# Altium schematic sheet PWR_SRC.SchDoc
size A3
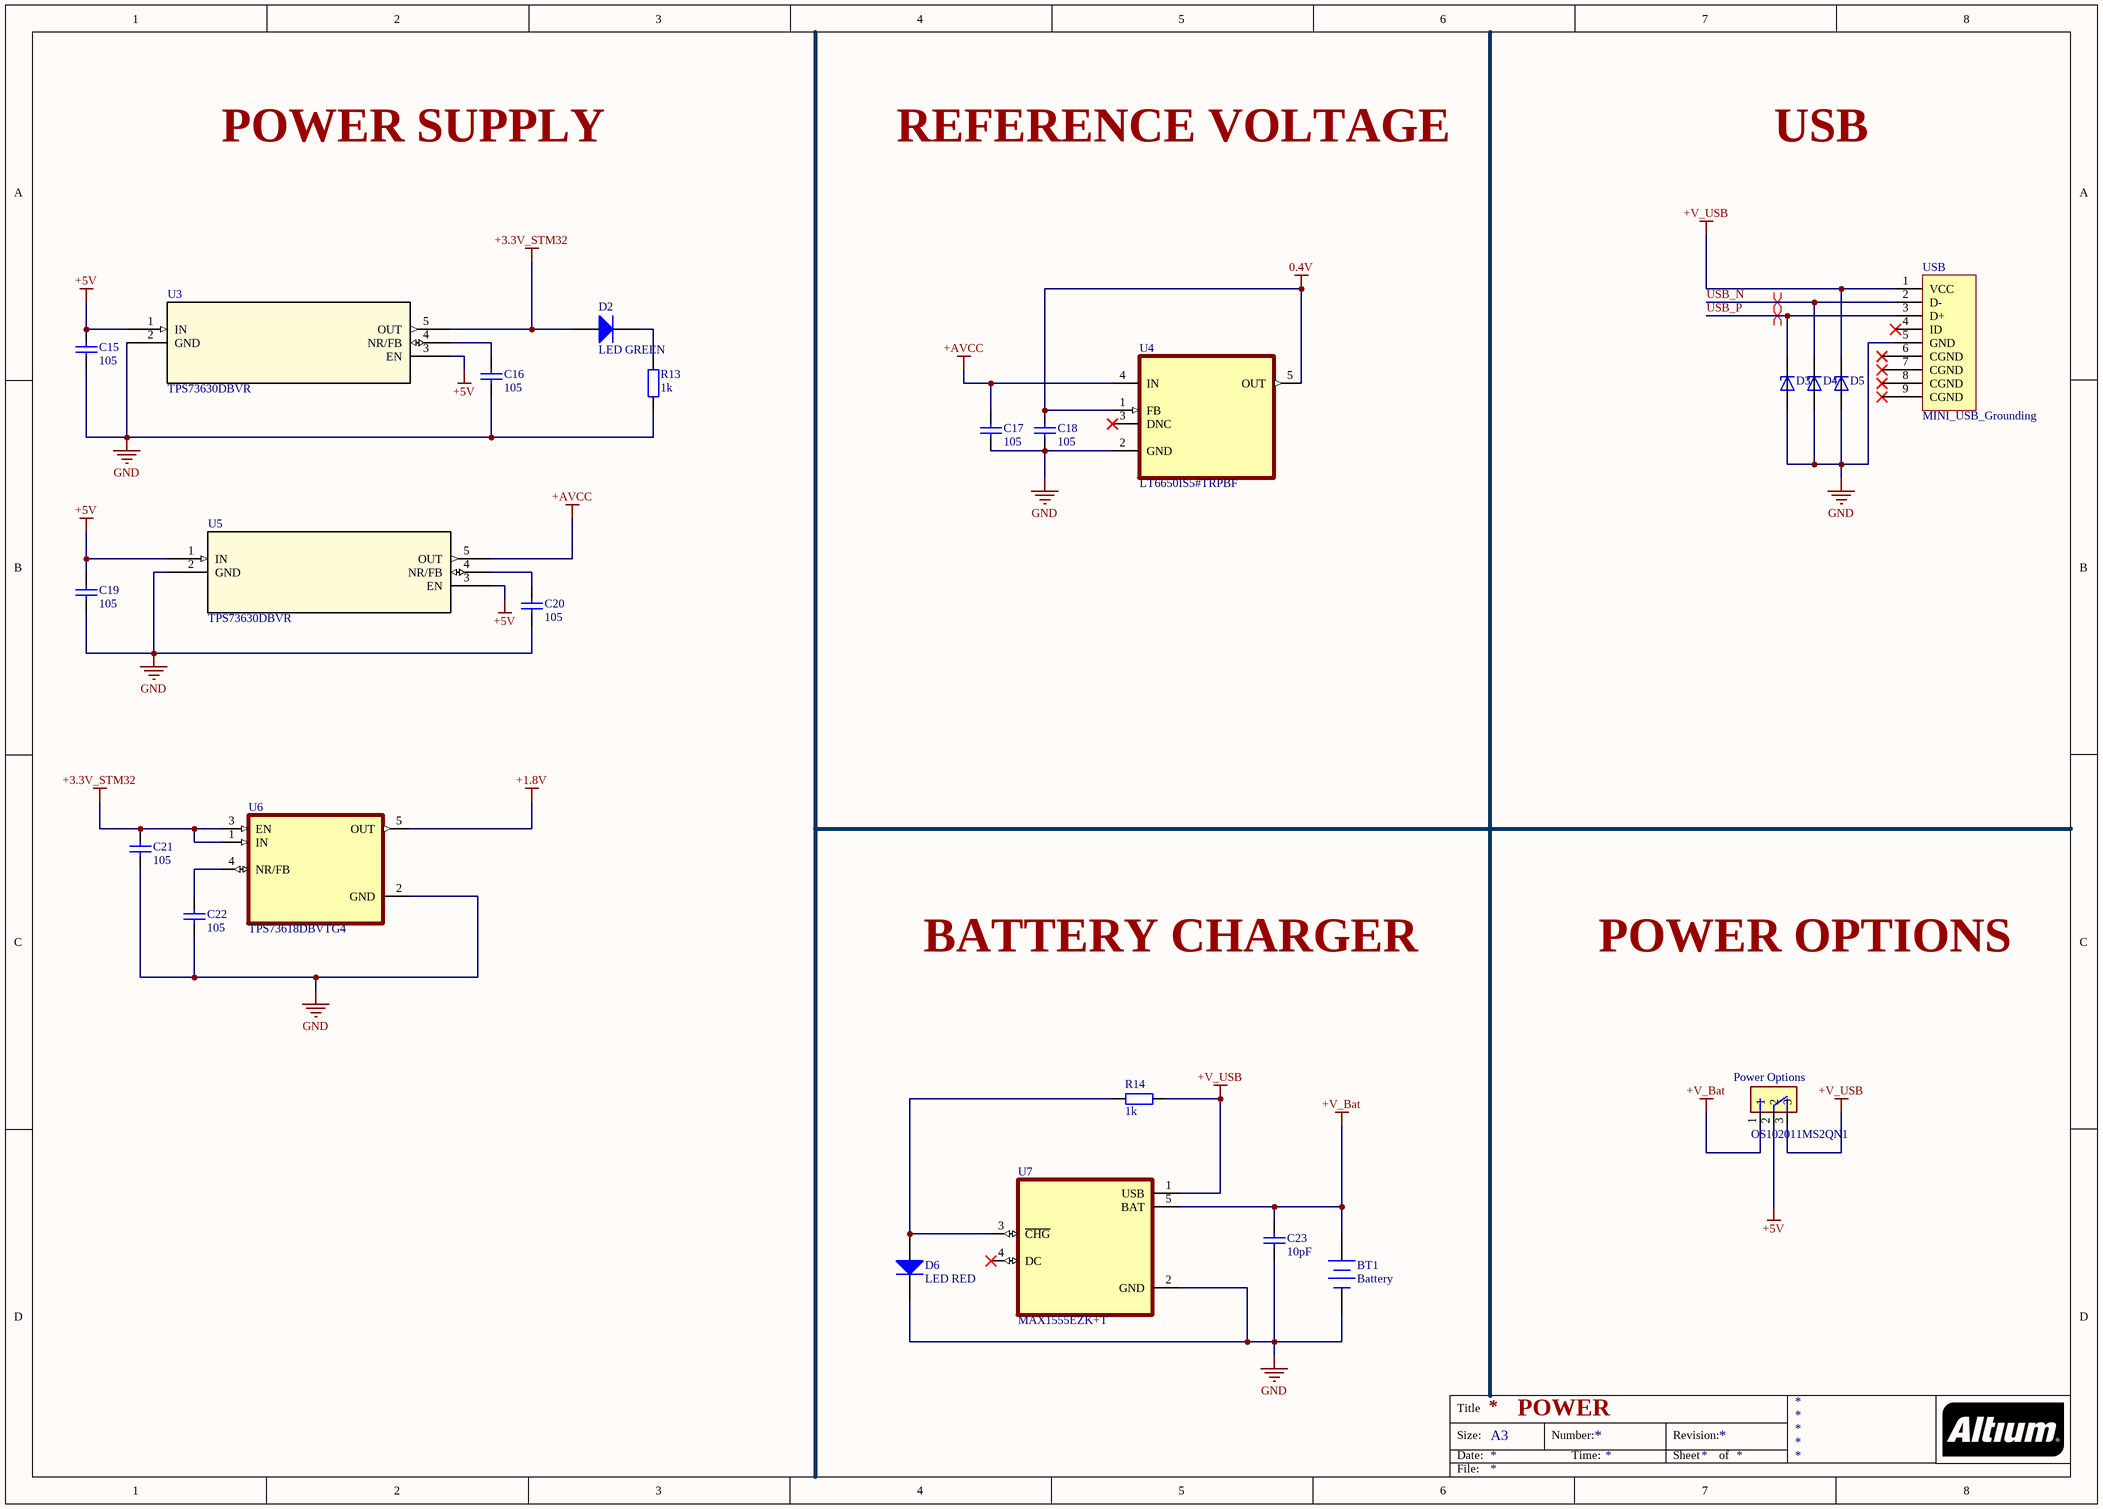
[diagram p0: PWR_SRC.SchDoc]

## Parts
BT1  Battery  [BAT-2]
C15  105  [tu 0603]
C16  105  [tu 0603]
C17  105  [tu 0603]
C18  105  [tu 0603]
C19  105  [tu 0603]
C20  105  [tu 0603]
C21  105  [tu 0603]
C22  105  [tu 0603]
C23  10pF  [tu 0805]
D2  LED GREEN  [J1-0603]
D3  AVRL161A1R1NTA  [TVS_AVRL161A1R1NTA]  (value not drawn)
D4  AVRL161A1R1NTA  [TVS_AVRL161A1R1NTA]  (value not drawn)
D5  AVRL161A1R1NTA  [TVS_AVRL161A1R1NTA]  (value not drawn)
D6  LED RED  [J1-0603]
Power_Options  OS102011MS2QN1  [SW_OS102011MS2QN1]
R13  1k  [tro smd 0603]
R14  1k  [tro smd 0603]
U3  TPS73630DBVR  [DBV5-M]
U4  LT6650IS5#TRPBF  [SOT95P280X100-5N]
U5  TPS73630DBVR  [DBV5-M]
U6  TPS73618DBVTG4  [SOT95P280X145-5N]
U7  MAX1555EZK+T  [SOT95P275X110-5N]
USB  MINI_USB_Grounding  [micro_USB shilding]

## Nets
0.4V: C18.1 U4.1(FB) U4.5(OUT)
+1.8V: U6.5(OUT)
+3.3V_STM32: C21.1 D2.1(A) U3.5(OUT) U6.1(IN) U6.3(EN)
+5V: C15.1 C19.1 Power_Options.2 U3.1(IN) U3.3(EN) U5.1(IN) U5.3(EN)
+AVCC: C17.1 U4.4(IN) U5.5(OUT)
+V_Bat: BT1.1(+) C23.1 Power_Options.1 U7.5(BAT)
+V_USB: D5.1(C) Power_Options.3 R14.2 U7.1(USB) USB.1(VCC)
GND: BT1.2(-) C15.2 C16.2 C17.2 C18.2 C19.2 C20.2 C21.2 C22.2 C23.2 D3.2(A) D4.2(A) D5.2(A) D6.2(K) R13.2 U3.2(GND) U4.2(GND) U5.2(GND) U6.2(GND) U7.2(GND) USB.5(GND)
USB_N: D4.1(C) USB.2(D-)
USB_P: D3.1(C) USB.3(D+)
NetC16_1: C16.1 U3.4(NR/FB)
NetC20_1: C20.1 U5.4(NR/FB)
NetC22_1: C22.1 U6.4(NR/FB)
NetD2_2: D2.2(K) R13.1
NetD6_1: D6.1(A) R14.1 U7.3(~{CHG})

Not connected (* = marked no-connect by the designer): U4 3(DNC)*; U7 4(DC)*; USB 4(ID)* 6(CGND)* 7(CGND)* 8(CGND)* 9(CGND)*

## Layout directives
differential pair; differential pair class diff90: USB_N, USB_P

## Notes on the sheet
- POWER SUPPLY
- REFERENCE VOLTAGE
- USB
- BATTERY CHARGER
- POWER OPTIONS
- POWER
- Title
- Size:
- Date:
- A3
- Number:
- Time:
- Revision:
- Sheet
- of
- File:

## Library data of the parts
BT1 = Battery: Multicell Battery; Published: 24-Mar-1999; LatestRevisionDate: 17-Jul-2002; LatestRevisionNote: Re-released for DXP Platform.; PackageReference: BAT-2; Publisher: Altium Limited; PackageDescription: Battery; 2 Leads
C15-C22 = Tu 0603 105 16V 20%: Dán; Don_Vi: Con; So_Chan: 2; Ten_Linh_Kien: Tụ 0603 105-1uF 20% 16V; Ma_Hang: MH004574; Chung_Loai: Dán; Kieu_Chan: *
C23 = Tu 0805 10pF 50V 10%: Dán; Don_Vi: Con; So_Chan: 2; Ten_Linh_Kien: Tụ 0805 10P 10% 50V; Ma_Hang: MH004554; Chung_Loai: Dán; Kieu_Chan: *
D2 D6 = Diode: Default Diode; Published: 8-Jun-2000; LatestRevisionDate: 17-Jul-2002; LatestRevisionNote: Re-released for DXP Platform.; PackageDocument: Sep-1996; PackageReference: SMC; Publisher: Altium Limited; Code_JEDEC: DO-214-AB
D3-D5 = AVRL161A1R1NTA: MF: {'manufacturer': u'TDK'}; Package: None; Price: None; Value: *; MP: AVRL161A1R1NTA; Availability: Unavailable
Power_Options = OS102011MS2QN1: Switch Slide ON ON SPDT Top Slide 0.1A 12VDC 10000Cycles PC Pins Thru-Hole Bulk; MF: {'manufacturer': u'C&K'}; Package: None; Price: None; Value: *; MP: OS102011MS2QN1; Availability: Unavailable
R13 = Tro 0603 5% 1k: Dán; Don_Vi: Con; So_Chan: 2; Ten_Linh_Kien: Trở 0603 5% 1k; Ma_Hang: MH006319; Chung_Loai: Dán; Kieu_Chan: *
R14 = Tro 0603 1% 1k: Dán; So_Chan: 2; Don_Vi: Con; Ten_Linh_Kien: Trở 0603 1% 1k; Ma_Hang: MH006334; Chung_Loai: Dán; Kieu_Chan: *
U3 U5 = TPS73630DBVR: No Description Available; Mfr_Name: Texas Instruments; RefDes: RefDes; Type: Type
U4 = LT6650IS5#TRPBF: Micropower, 400mV Reference with Rail-to-Rail Buffer Amplifier; MF: {'manufacturer': u'Analog Devices'}; Package: None; Price: None; Value: *; MP: LT6650IS5#TRPBF; Availability: Unavailable
U6 = TPS73618DBVTG4: MF: {'manufacturer': u'Texas Instruments'}; Package: None; Price: None; Value: *; MP: TPS73618DBVTG4; Availability: Unavailable
U7 = MAX1555EZK+T: MF: {'manufacturer': u'Analog Devices'}; Package: None; Price: None; Value: *; MP: MAX1555EZK+; Availability: Unavailable